# EAGLE schematic keyBoard_A (EAGLE 6.4)
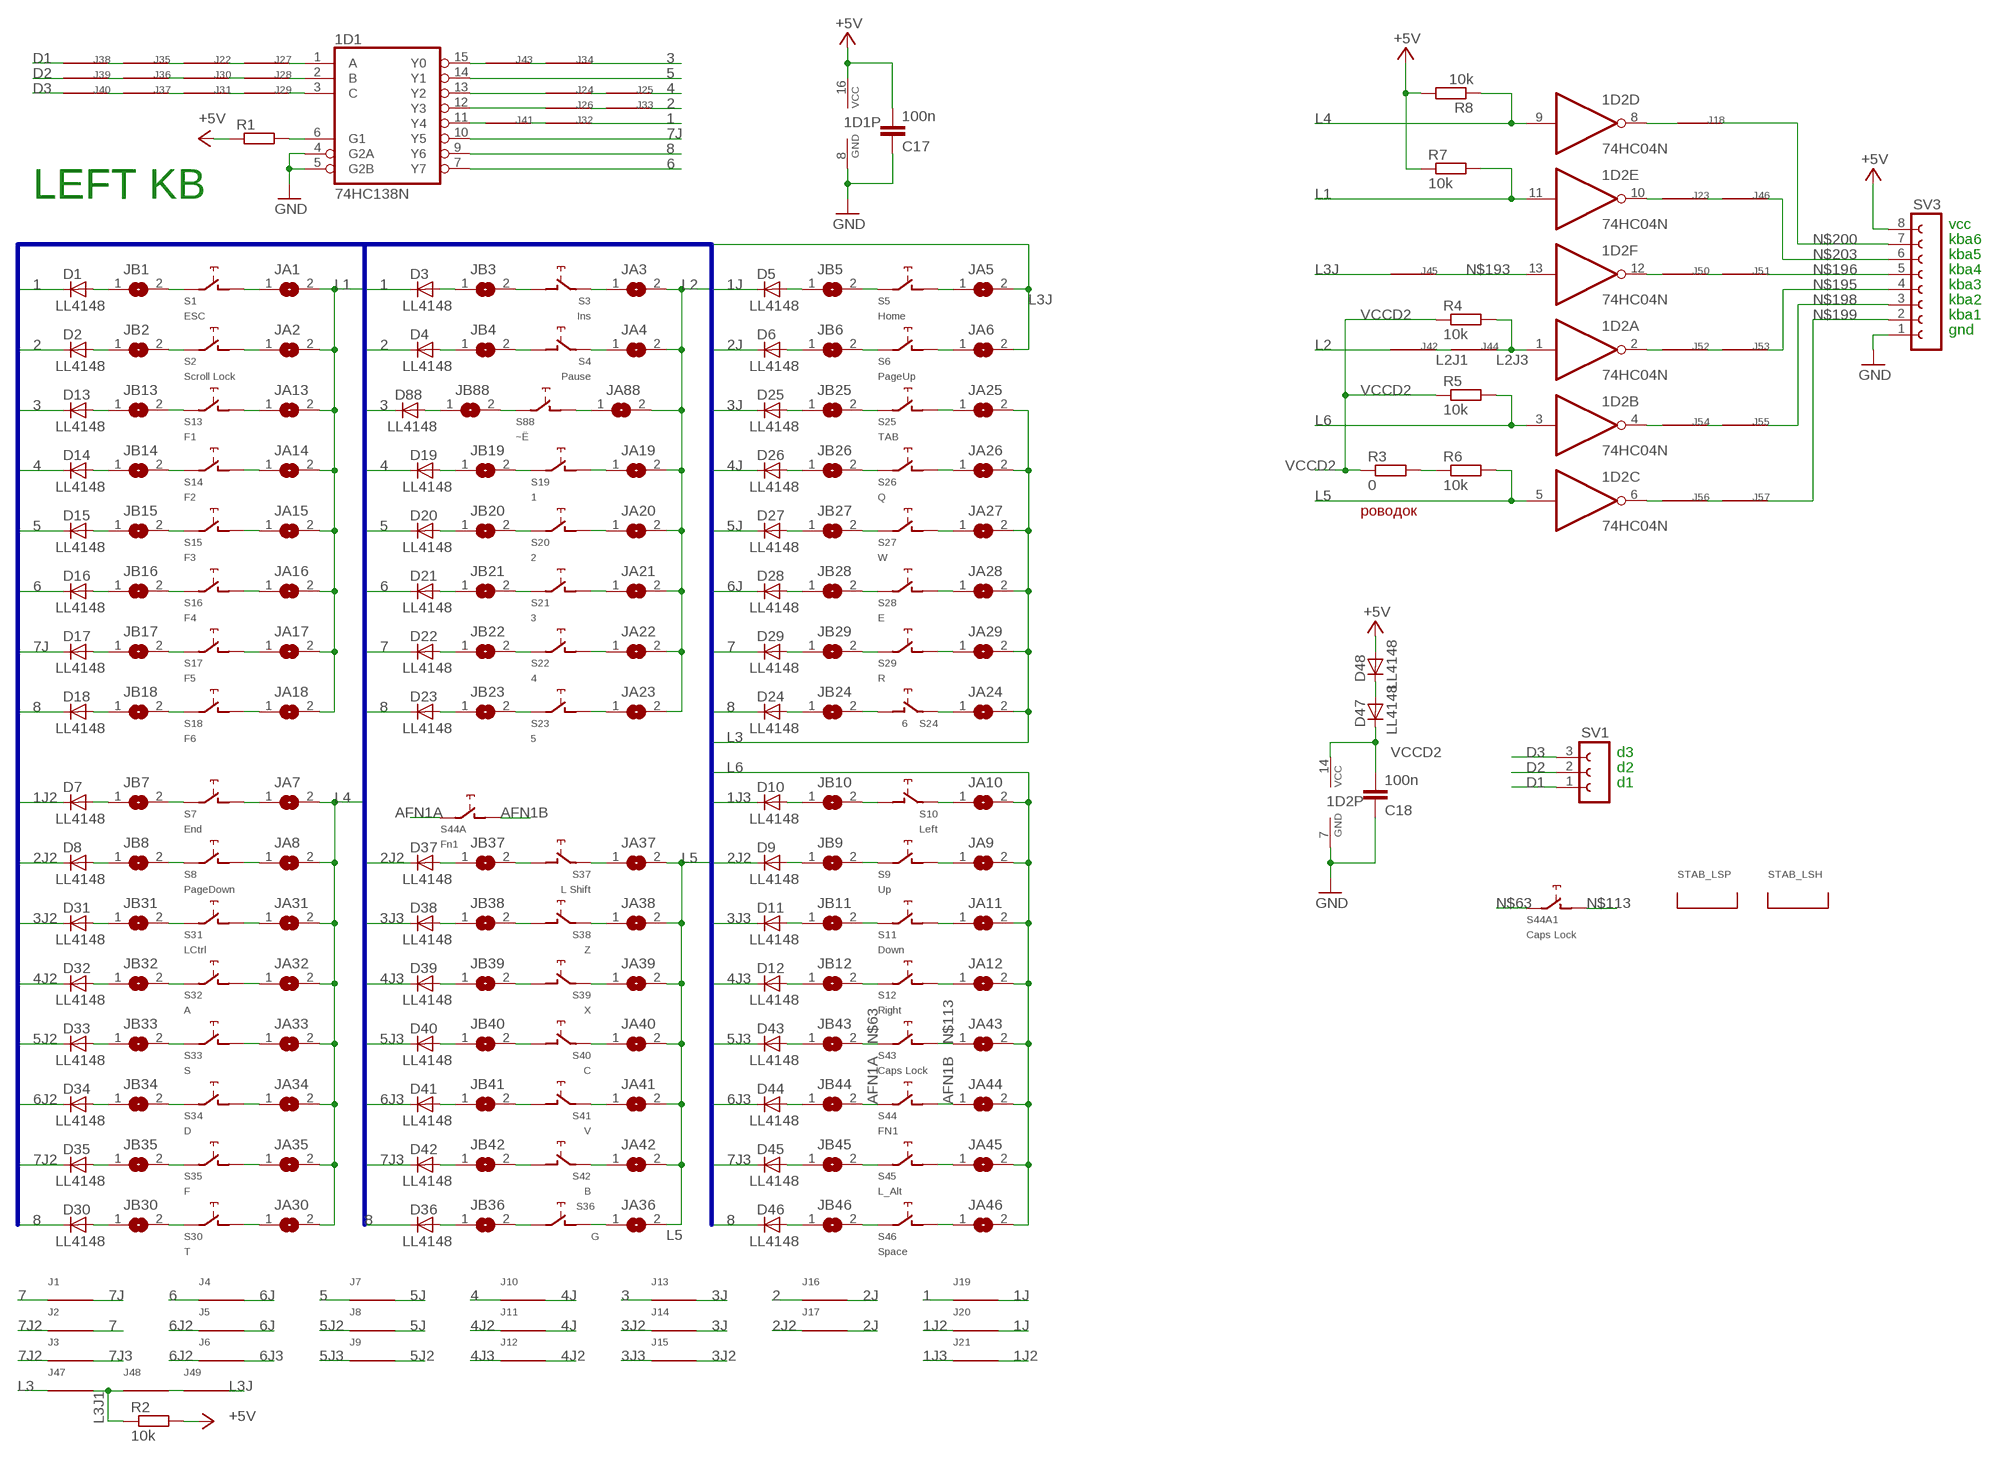
[diagram p0: schematic, sheet 1]

## Parts
1D1  74HC138N  [DIL16]
1D2  74HC04N  74ACT04N  [DIL14]
C17  100n  C-EUC0805  [C0805]
C18  100n  C-EUC0805  [C0805]
D1  LL4148  [SOD80C]
D2  LL4148  [SOD80C]
D3  LL4148  [SOD80C]
D4  LL4148  [SOD80C]
D5  LL4148  [SOD80C]
D6  LL4148  [SOD80C]
D7  LL4148  [SOD80C]
D8  LL4148  [SOD80C]
D9  LL4148  [SOD80C]
D10  LL4148  [SOD80C]
D11  LL4148  [SOD80C]
D12  LL4148  [SOD80C]
D13  LL4148  [SOD80C]
D14  LL4148  [SOD80C]
D15  LL4148  [SOD80C]
D16  LL4148  [SOD80C]
D17  LL4148  [SOD80C]
D18  LL4148  [SOD80C]
D19  LL4148  [SOD80C]
D20  LL4148  [SOD80C]
D21  LL4148  [SOD80C]
D22  LL4148  [SOD80C]
D23  LL4148  [SOD80C]
D24  LL4148  [SOD80C]
D25  LL4148  [SOD80C]
D26  LL4148  [SOD80C]
D27  LL4148  [SOD80C]
D28  LL4148  [SOD80C]
D29  LL4148  [SOD80C]
D30  LL4148  [SOD80C]
D31  LL4148  [SOD80C]
D32  LL4148  [SOD80C]
D33  LL4148  [SOD80C]
D34  LL4148  [SOD80C]
D35  LL4148  [SOD80C]
D36  LL4148  [SOD80C]
D37  LL4148  [SOD80C]
D38  LL4148  [SOD80C]
D39  LL4148  [SOD80C]
D40  LL4148  [SOD80C]
D41  LL4148  [SOD80C]
D42  LL4148  [SOD80C]
D43  LL4148  [SOD80C]
D44  LL4148  [SOD80C]
D45  LL4148  [SOD80C]
D46  LL4148  [SOD80C]
D47  LL4148  [SOD80C]
D48  LL4148  [SOD80C]
D88  LL4148  [SOD80C]
J1  J  [R1206W]
J2  J  [R1206W]
J3  J  [R1206W]
J4  J  [R1206W]
J5  J  [R1206W]
J6  J  [R1206W]
J7  J  [R1206W]
J8  J  [R1206W]
J9  J  [R1206W]
J10  J  [R1206W]
J11  J  [R1206W]
J12  J  [R1206W]
J13  J  [R1206W]
J14  J  [R1206W]
J15  J  [R1206W]
J16  J  [R1206W]
J17  J  [R1206W]
J18  J  [R1206W]
J19  J  [R1206W]
J20  J  [R1206W]
J21  J  [R1206W]
J22  J  [R1206W]
J23  J  [R1206W]
J24  J  [R1206W]
J25  J  [R1206W]
J26  J  [R1206W]
J27  J  [R1206W]
J28  J  [R1206W]
J29  J  [R1206W]
J30  J  [R1206W]
J31  J  [R1206W]
J32  J  [R1206W]
J33  J  [R1206W]
J34  J  [R1206W]
J35  J  [R1206W]
J36  J  [R1206W]
J37  J  [R1206W]
J38  J  [R1206W]
J39  J  [R1206W]
J40  J  [R1206W]
J41  J  [R1206W]
J42  J  [R1206W]
J43  J  [R1206W]
J44  J  [R1206W]
J45  J  [R1206W]
J46  J  [R1206W]
J47  J  [R1206W]
J48  J  [R1206W]
J49  J  [R1206W]
J50  J  [R1206W]
J51  J  [R1206W]
J52  J  [R1206W]
J53  J  [R1206W]
J54  J  [R1206W]
J55  J  [R1206W]
J56  J  [R1206W]
J57  J  [R1206W]
JA1  SJ  [SJ]
JA2  SJ  [SJ]
JA3  SJ  [SJ]
JA4  SJ  [SJ]
JA5  SJ  [SJ]
JA6  SJ  [SJ]
JA7  SJ  [SJ]
JA8  SJ  [SJ]
JA9  SJ  [SJ]
JA10  SJ  [SJ]
JA11  SJ  [SJ]
JA12  SJ  [SJ]
JA13  SJ  [SJ]
JA14  SJ  [SJ]
JA15  SJ  [SJ]
JA16  SJ  [SJ]
JA17  SJ  [SJ]
JA18  SJ  [SJ]
JA19  SJ  [SJ]
JA20  SJ  [SJ]
JA21  SJ  [SJ]
JA22  SJ  [SJ]
JA23  SJ  [SJ]
JA24  SJ  [SJ]
JA25  SJ  [SJ]
JA26  SJ  [SJ]
JA27  SJ  [SJ]
JA28  SJ  [SJ]
JA29  SJ  [SJ]
JA30  SJ  [SJ]
JA31  SJ  [SJ]
JA32  SJ  [SJ]
JA33  SJ  [SJ]
JA34  SJ  [SJ]
JA35  SJ  [SJ]
JA36  SJ  [SJ]
JA37  SJ  [SJ]
JA38  SJ  [SJ]
JA39  SJ  [SJ]
JA40  SJ  [SJ]
JA41  SJ  [SJ]
JA42  SJ  [SJ]
JA43  SJ  [SJ]
JA44  SJ  [SJ]
JA45  SJ  [SJ]
JA46  SJ  [SJ]
JA88  SJ  [SJ]
JB1  SJ  [SJ]
JB2  SJ  [SJ@1]
JB3  SJ  [SJ]
JB4  SJ  [SJ]
JB5  SJ  [SJ@1]
JB6  SJ  [SJ]
JB7  SJ  [SJ]
JB8  SJ  [SJ]
JB9  SJ  [SJ]
JB10  SJ  [SJ]
JB11  SJ  [SJ]
JB12  SJ  [SJ]
JB13  SJ  [SJ]
JB14  SJ  [SJ@1]
JB15  SJ  [SJ@1]
JB16  SJ  [SJ]
JB17  SJ  [SJ]
JB18  SJ  [SJ]
JB19  SJ  [SJ]
JB20  SJ  [SJ]
JB21  SJ  [SJ]
JB22  SJ  [SJ]
JB23  SJ  [SJ]
JB24  SJ  [SJ]
JB25  SJ  [SJ]
JB26  SJ  [SJ]
JB27  SJ  [SJ]
JB28  SJ  [SJ]
JB29  SJ  [SJ]
JB30  SJ  [SJ]
JB31  SJ  [SJ]
JB32  SJ  [SJ]
JB33  SJ  [SJ]
JB34  SJ  [SJ]
JB35  SJ  [SJ]
JB36  SJ  [SJ]
JB37  SJ  [SJ]
JB38  SJ  [SJ]
JB39  SJ  [SJ]
JB40  SJ  [SJ]
JB41  SJ  [SJ]
JB42  SJ  [SJ]
JB43  SJ  [SJ]
JB44  SJ  [SJ]
JB45  SJ  [SJ]
JB46  SJ  [SJ]
JB88  SJ  [SJ]
R1  R-EU_R1206W  [R1206W]
R2  10k  R-EU_R1206W  [R1206W]
R3  0  R-EU_R1206W  [R1206W]
R4  10k  R-EU_R0805  [R0805]
R5  10k  R-EU_R1206W  [R1206W]
R6  10k  R-EU_R1206W  [R1206W]
R7  10k  R-EU_R1206W  [R1206W]
R8  10k  R-EU_R0805  [R0805]
S1  ESC  CHERRY-MX-4P  [CHERRY-MX-4P]
S2  Scroll Lock  CHERRY-MX-4P  [CHERRY-MX-4P]
S3  Ins  CHERRY-MX-4P  [CHERRY-MX-4P]
S4  Pause  CHERRY-MX-4P  [CHERRY-MX-4P]
S5  Home  CHERRY-MX-4P  [CHERRY-MX-4P]
S6  PageUp  CHERRY-MX-4P  [CHERRY-MX-4P]
S7  End  CHERRY-MX-4P  [CHERRY-MX-4P]
S8  PageDown  CHERRY-MX-4P  [CHERRY-MX-4P]
S9  Up  CHERRY-MX-4P  [CHERRY-MX-4P]
S10  Left  CHERRY-MX-4P  [CHERRY-MX-4P]
S11  Down  CHERRY-MX-4P  [CHERRY-MX-4P]
S12  Right  CHERRY-MX-4P  [CHERRY-MX-4P]
S13  F1  CHERRY-MX-4P  [CHERRY-MX-4P]
S14  F2  CHERRY-MX-4P  [CHERRY-MX-4P]
S15  F3  CHERRY-MX-4P  [CHERRY-MX-4P]
S16  F4  CHERRY-MX-4P  [CHERRY-MX-4P]
S17  F5  CHERRY-MX-4P  [CHERRY-MX-4P]
S18  F6  CHERRY-MX-4P  [CHERRY-MX-4P]
S19  1  CHERRY-MX-4P  [CHERRY-MX-4P]
S20  2  CHERRY-MX-4P  [CHERRY-MX-4P]
S21  3  CHERRY-MX-4P  [CHERRY-MX-4P]
S22  4  CHERRY-MX-4P  [CHERRY-MX-4P]
S23  5  CHERRY-MX-4P  [CHERRY-MX-4P]
S24  6  CHERRY-MX-4P  [CHERRY-MX-4P]
S25  TAB  CHERRY-MX-4P  [CHERRY-MX-4P]
S26  Q  CHERRY-MX-4P  [CHERRY-MX-4P]
S27  W  CHERRY-MX-4P  [CHERRY-MX-4P]
S28  E  CHERRY-MX-4P  [CHERRY-MX-4P]
S29  R  CHERRY-MX-4P  [CHERRY-MX-4P]
S30  T  CHERRY-MX-4P  [CHERRY-MX-4P]
S31  LCtrl  CHERRY-MX-4P  [CHERRY-MX-4P]
S32  A  CHERRY-MX-4P  [CHERRY-MX-4P]
S33  S  CHERRY-MX-4P  [CHERRY-MX-4P]
S34  D  CHERRY-MX-4P  [CHERRY-MX-4P]
S35  F  CHERRY-MX-4P  [CHERRY-MX-4P]
S36  G  CHERRY-MX-4P  [CHERRY-MX-4P]
S37  L Shift  CHERRY-MX-4P  [CHERRY-MX-4P]
S38  Z  CHERRY-MX-4P  [CHERRY-MX-4P]
S39  X  CHERRY-MX-4P  [CHERRY-MX-4P]
S40  C  CHERRY-MX-4P  [CHERRY-MX-4P]
S41  V  CHERRY-MX-4P  [CHERRY-MX-4P]
S42  B  CHERRY-MX-4P  [CHERRY-MX-4P]
S43  Caps Lock  CHERRY-MX-4P  [CHERRY-MX-4P]
S44  FN1  CHERRY-MX-4P  [CHERRY-MX-4P]
S44A  Fn1  CHERRY-MX  [CHERRY-MX]
S44A1  Caps Lock  CHERRY-MX  [CHERRY-MX]
S45  L_Alt  CHERRY-MX-4P  [CHERRY-MX-4P]
S46  Space  CHERRY-MX-4P  [CHERRY-MX-4P]
S88  ~Ё  CHERRY-MX-4P  [CHERRY-MX-4P]
STAB_LSH  STAB  [ZEALIOS-PCB_2U]
STAB_LSP  STAB  [ZEALIOS-PCB_2U]
SV1  FE03-1  [FE03-1]
SV3  FE08-1  [FE08]

## Nets
1: D1.C D3.C J19.2 J32.1
1J: D5.C J19.1 J20.1
1J2: D7.C J20.2 J21.1
1J3: D10.C J21.2
2: D2.C D4.C J16.2 J33.1
2J: D6.C J16.1 J17.1
2J2: D8.C D9.C D37.C J17.2
3: D13.C D88.C J13.2 J34.1
3J: D25.C J13.1 J14.1
3J2: D31.C J14.2 J15.1
3J3: D11.C D38.C J15.2
4: D14.C D19.C J10.2 J25.1
4J: D26.C J10.1 J11.1
4J2: D32.C J11.2 J12.1
4J3: D12.C D39.C J12.2
5: 1D1.14(Y1) D15.C D20.C J7.2
5J: D27.C J7.1 J8.1
5J2: D33.C J8.2 J9.1
5J3: D40.C D43.C J9.2
6: 1D1.7(Y7) D16.C D21.C J4.2
6J: D28.C J4.1 J5.1
6J2: D34.C J5.2 J6.2
6J3: D41.C D44.C J6.1
7: D22.C D29.C J1.2 J2.1
7J: 1D1.10(Y5) D17.C J1.1
7J2: D35.C J2.2 J3.2
7J3: D42.C D45.C J3.1
8: 1D1.9(Y6) D18.C D23.C D24.C D30.C D36.C D46.C
+5V: 1D1.16(VCC) C17.2 D48.A R1.1 R2.2 R7.1 R8.2 SV3.8
AFN1A: JB44.2 S44.SW1(PIN-1) S44A.SW1(PIN-1)
AFN1B: JA44.1 S44.SW2(PIN-2) S44A.SW2(PIN-2)
D1: J38.2 SV1.1
D2: J39.2 SV1.2
D3: J40.2 SV1.3
GND: 1D1.4(G2A) 1D1.5(G2B) 1D1.8(GND) 1D2.7(P:GND) C17.1 C18.1 SV3.1
L1: 1D2.11(E:I) JA1.2 JA2.2 JA13.2 JA14.2 JA15.2 JA16.2 JA17.2 JA18.2 R7.2
L2: J42.2 JA3.2 JA4.2 JA19.2 JA20.2 JA21.2 JA22.2 JA23.2 JA88.2
L2J1: J42.1 J44.2
L2J3: 1D2.1(A:I) J44.1 R4.2
L3: J47.2 JA24.2 JA25.2 JA26.2 JA27.2 JA28.2 JA29.2
L3J: J45.2 J49.1 JA5.2 JA6.2
L3J1: J47.1 J48.2 R2.1
L4: 1D2.9(D:I) JA7.2 JA8.2 JA30.2 JA31.2 JA32.2 JA33.2 JA34.2 JA35.2 R8.1
L5: 1D2.5(C:I) JA36.2 JA37.2 JA38.2 JA39.2 JA40.2 JA41.2 JA42.2 R6.2
L5O: 1D2.6(C:O) J56.2
L6: 1D2.3(B:I) JA9.2 JA10.2 JA11.2 JA12.2 JA43.2 JA44.2 JA45.2 JA46.2 R5.2
N$1: D15.A JB15.1
N$2: JB4.2 S4.SW2(PIN-2)
N$3: D1.A JB1.1
N$4: JA4.1 S4.SW1(PIN-1)
N$5: JB14.2 S14.SW1(PIN-1)
N$6: JB20.2 S20.SW1(PIN-1)
N$7: JB32.2 S32.SW1(PIN-1)
N$8: JB38.2 S38.SW2(PIN-2)
N$9: JB6.2 S6.SW1(PIN-1)
N$10: JA6.1 S6.SW2(PIN-2)
N$11: JA8.1 S8.SW2(PIN-2)
N$12: JB8.2 S8.SW1(PIN-1)
N$13: JB10.2 S10.SW2(PIN-2)
N$14: JB1.2 S1.SW1(PIN-1)
N$15: D2.A JB2.1
N$16: JB2.2 S2.SW1(PIN-1)
N$17: JA2.1 S2.SW2(PIN-2)
N$18: D16.A JB16.1
N$19: JB3.2 S3.SW2(PIN-2)
N$20: JB5.2 S5.SW1(PIN-1)
N$21: JB7.2 S7.SW1(PIN-1)
N$22: JB9.2 S9.SW1(PIN-1)
N$23: JB11.2 S11.SW1(PIN-1)
N$24: D3.A JB3.1
N$25: JB12.2 S12.SW1(PIN-1)
N$26: D5.A JB5.1
N$27: D7.A JB7.1
N$28: JA10.1 S10.SW1(PIN-1)
N$29: JA1.1 S1.SW2(PIN-2)
N$30: D9.A JB9.1
N$31: D11.A JB11.1
N$32: JA3.1 S3.SW1(PIN-1)
N$33: JA5.1 S5.SW2(PIN-2)
N$34: JA7.1 S7.SW2(PIN-2)
N$35: JA9.1 S9.SW2(PIN-2)
N$36: JA11.1 S11.SW2(PIN-2)
N$37: JA12.1 S12.SW2(PIN-2)
N$38: JA14.1 S14.SW2(PIN-2)
N$39: JB13.2 S13.SW1(PIN-1)
N$40: JA13.1 S13.SW2(PIN-2)
N$41: D14.A JB14.1
N$42: JB42.2 S42.SW2(PIN-2)
N$43: JA42.1 S42.SW1(PIN-1)
N$44: JB27.2 S27.SW1(PIN-1)
N$45: JA27.1 S27.SW2(PIN-2)
N$46: JB17.2 S17.SW1(PIN-1)
N$47: JA17.1 S17.SW2(PIN-2)
N$48: D24.A JB24.1
N$49: JB24.2 S24.SW2(PIN-2)
N$50: JA24.1 S24.SW1(PIN-1)
N$51: J22.1 J27.2
N$52: D4.A JB4.1
N$53: D6.A JB6.1
N$54: D8.A JB8.1
N$55: D10.A JB10.1
N$56: D12.A JB12.1
N$57: D13.A JB13.1
N$58: JB19.2 S19.SW1(PIN-1)
N$59: JB25.2 S25.SW1(PIN-1)
N$60: 1D2.8(D:O) J18.2
N$61: JB31.2 S31.SW1(PIN-1)
N$62: JB37.2 S37.SW2(PIN-2)
N$63: JB43.2 S43.SW1(PIN-1) S44A1.SW1(PIN-1)
N$64: JB26.2 S26.SW1(PIN-1)
N$65: JB41.2 S41.SW2(PIN-2)
N$66: JB18.2 S18.SW1(PIN-1)
N$67: 1D1.13(Y2) J24.2
N$68: JB30.2 S30.SW1(PIN-1)
N$69: JB36.2 S36.SW1(PIN-1)
N$70: J24.1 J25.2
N$72: JB23.2 S23.SW1(PIN-1)
N$73: JB29.2 S29.SW1(PIN-1)
N$74: JB35.2 S35.SW1(PIN-1)
N$75: JA41.1 S41.SW1(PIN-1)
N$76: JB16.2 S16.SW1(PIN-1)
N$77: JB22.2 S22.SW1(PIN-1)
N$78: JB28.2 S28.SW1(PIN-1)
N$79: JB34.2 S34.SW1(PIN-1)
N$80: JB40.2 S40.SW2(PIN-2)
N$81: JB46.2 S46.SW1(PIN-1)
N$82: JB15.2 S15.SW1(PIN-1)
N$83: JB21.2 S21.SW1(PIN-1)
N$85: JB33.2 S33.SW1(PIN-1)
N$86: JB39.2 S39.SW2(PIN-2)
N$87: JB45.2 S45.SW1(PIN-1)
N$88: JA15.1 S15.SW2(PIN-2)
N$90: JA18.1 S18.SW2(PIN-2)
N$91: JA20.1 S20.SW2(PIN-2)
N$92: JA22.1 S22.SW2(PIN-2)
N$93: JA23.1 S23.SW2(PIN-2)
N$95: JA25.1 S25.SW2(PIN-2)
N$96: JA26.1 S26.SW2(PIN-2)
N$98: JA28.1 S28.SW2(PIN-2)
N$99: JA29.1 S29.SW2(PIN-2)
N$100: JA30.1 S30.SW2(PIN-2)
N$101: JA31.1 S31.SW2(PIN-2)
N$102: JA32.1 S32.SW2(PIN-2)
N$103: JA33.1 S33.SW2(PIN-2)
N$104: JA34.1 S34.SW2(PIN-2)
N$105: JA35.1 S35.SW2(PIN-2)
N$106: JA36.1 S36.SW2(PIN-2)
N$108: JA38.1 S38.SW1(PIN-1)
N$109: JA39.1 S39.SW1(PIN-1)
N$110: JA40.1 S40.SW1(PIN-1)
N$111: JB88.2 S88.SW1(PIN-1)
N$113: JA43.1 S43.SW2(PIN-2) S44A1.SW2(PIN-2)
N$114: JA45.1 S45.SW2(PIN-2)
N$115: JA46.1 S46.SW2(PIN-2)
N$116: JA19.1 S19.SW2(PIN-2)
N$117: JA88.1 S88.SW2(PIN-2)
N$118: JA21.1 S21.SW2(PIN-2)
N$119: JA16.1 S16.SW2(PIN-2)
N$120: D17.A JB17.1
N$121: D18.A JB18.1
N$122: D19.A JB19.1
N$123: D20.A JB20.1
N$124: D21.A JB21.1
N$125: D22.A JB22.1
N$126: D23.A JB23.1
N$128: D25.A JB25.1
N$129: D26.A JB26.1
N$130: D27.A JB27.1
N$131: D28.A JB28.1
N$132: D29.A JB29.1
N$133: D30.A JB30.1
N$134: D31.A JB31.1
N$135: D32.A JB32.1
N$136: D33.A JB33.1
N$137: D34.A JB34.1
N$138: D35.A JB35.1
N$139: D36.A JB36.1
N$140: D37.A JB37.1
N$141: D38.A JB38.1
N$142: D39.A JB39.1
N$143: D40.A JB40.1
N$144: D41.A JB41.1
N$145: D42.A JB42.1
N$146: D43.A JB43.1
N$147: D44.A JB44.1
N$148: D45.A JB45.1
N$149: D46.A JB46.1
N$151: D88.A JB88.1
N$158: 1D1.15(Y0) J43.2
N$163: 1D1.1(A) J27.1
N$165: 1D1.2(B) J28.1
N$172: 1D1.3(C) J29.1
N$175: J28.2 J30.1
N$176: J29.2 J31.1
N$178: J26.1 J33.2
N$182: J35.2 J38.1
N$183: J36.2 J39.1
N$184: J37.2 J40.1
N$185: J31.2 J37.1
N$186: J30.2 J36.1
N$187: J22.2 J35.1
N$188: J32.2 J41.1
N$189: 1D1.11(Y4) J41.2
N$190: 1D1.12(Y3) J26.2
N$191: J34.2 J43.1
N$192: D47.A D48.C
N$193: 1D2.13(F:I) J45.1
N$195: J53.1 SV3.4
N$196: J51.1 SV3.5
N$197: 1D2.10(E:O) J23.2
N$198: J55.1 SV3.3
N$199: J57.1 SV3.2
N$200: J18.1 SV3.7
N$203: J46.1 SV3.6
N$224: J48.1 J49.2
N$225: J23.1 J46.2
N$229: 1D2.12(F:O) J50.2
N$230: J50.1 J51.2
N$231: 1D2.2(A:O) J52.2
N$232: J52.1 J53.2
N$233: 1D2.4(B:O) J54.2
N$234: JA37.1 S37.SW1(PIN-1)
N$235: J54.1 J55.2
N$237: J56.1 J57.2
N$238: R3.2 R6.1
N$390: 1D1.6(G1) R1.2
VCCD2: 1D2.14(P:VCC) C18.2 D47.C R3.1 R4.1 R5.1
Unconnected: S1.D1(_D:D1) S1.D2(_D:D2) S1.LED1(_L:LED1) S1.LED2(_L:LED2) S2.D1(_D:D1) S2.D2(_D:D2) S2.LED1(_L:LED1) S2.LED2(_L:LED2) S3.D1(_D:D1) S3.D2(_D:D2) S3.LED1(_L:LED1) S3.LED2(_L:LED2) S4.D1(_D:D1) S4.D2(_D:D2) S4.LED1(_L:LED1) S4.LED2(_L:LED2) S5.D1(_D:D1) S5.D2(_D:D2) S5.LED1(_L:LED1) S5.LED2(_L:LED2) S6.D1(_D:D1) S6.D2(_D:D2) S6.LED1(_L:LED1) S6.LED2(_L:LED2) S7.D1(_D:D1) S7.D2(_D:D2) S7.LED1(_L:LED1) S7.LED2(_L:LED2) S8.D1(_D:D1) S8.D2(_D:D2) S8.LED1(_L:LED1) S8.LED2(_L:LED2) S9.D1(_D:D1) S9.D2(_D:D2) S9.LED1(_L:LED1) S9.LED2(_L:LED2) S10.D1(_D:D1) S10.D2(_D:D2) S10.LED1(_L:LED1) S10.LED2(_L:LED2) S11.D1(_D:D1) S11.D2(_D:D2) S11.LED1(_L:LED1) S11.LED2(_L:LED2) S12.D1(_D:D1) S12.D2(_D:D2) S12.LED1(_L:LED1) S12.LED2(_L:LED2) S13.D1(_D:D1) S13.D2(_D:D2) S13.LED1(_L:LED1) S13.LED2(_L:LED2) S14.D1(_D:D1) S14.D2(_D:D2) S14.LED1(_L:LED1) S14.LED2(_L:LED2) S15.D1(_D:D1) S15.D2(_D:D2) S15.LED1(_L:LED1) S15.LED2(_L:LED2) S16.D1(_D:D1) S16.D2(_D:D2) S16.LED1(_L:LED1) S16.LED2(_L:LED2) S17.D1(_D:D1) S17.D2(_D:D2) S17.LED1(_L:LED1) S17.LED2(_L:LED2) S18.D1(_D:D1) S18.D2(_D:D2) S18.LED1(_L:LED1) S18.LED2(_L:LED2) S19.D1(_D:D1) S19.D2(_D:D2) S19.LED1(_L:LED1) S19.LED2(_L:LED2) S20.D1(_D:D1) S20.D2(_D:D2) S20.LED1(_L:LED1) S20.LED2(_L:LED2) S21.D1(_D:D1) S21.D2(_D:D2) S21.LED1(_L:LED1) S21.LED2(_L:LED2) S22.D1(_D:D1) S22.D2(_D:D2) S22.LED1(_L:LED1) S22.LED2(_L:LED2) S23.D1(_D:D1) S23.D2(_D:D2) S23.LED1(_L:LED1) S23.LED2(_L:LED2) S24.D1(_D:D1) S24.D2(_D:D2) S24.LED1(_L:LED1) S24.LED2(_L:LED2) S25.D1(_D:D1) S25.D2(_D:D2) S25.LED1(_L:LED1) S25.LED2(_L:LED2) S26.D1(_D:D1) S26.D2(_D:D2) S26.LED1(_L:LED1) S26.LED2(_L:LED2) S27.D1(_D:D1) S27.D2(_D:D2) S27.LED1(_L:LED1) S27.LED2(_L:LED2) S28.D1(_D:D1) S28.D2(_D:D2) S28.LED1(_L:LED1) S28.LED2(_L:LED2) S29.D1(_D:D1) S29.D2(_D:D2) S29.LED1(_L:LED1) S29.LED2(_L:LED2) S30.D1(_D:D1) S30.D2(_D:D2) S30.LED1(_L:LED1) S30.LED2(_L:LED2) S31.D1(_D:D1) S31.D2(_D:D2) S31.LED1(_L:LED1) S31.LED2(_L:LED2) S32.D1(_D:D1) S32.D2(_D:D2) S32.LED1(_L:LED1) S32.LED2(_L:LED2) S33.D1(_D:D1) S33.D2(_D:D2) S33.LED1(_L:LED1) S33.LED2(_L:LED2) S34.D1(_D:D1) S34.D2(_D:D2) S34.LED1(_L:LED1) S34.LED2(_L:LED2) S35.D1(_D:D1) S35.D2(_D:D2) S35.LED1(_L:LED1) S35.LED2(_L:LED2) S36.D1(_D:D1) S36.D2(_D:D2) S36.LED1(_L:LED1) S36.LED2(_L:LED2) S37.D1(_D:D1) S37.D2(_D:D2) S37.LED1(_L:LED1) S37.LED2(_L:LED2) S38.D1(_D:D1) S38.D2(_D:D2) S38.LED1(_L:LED1) S38.LED2(_L:LED2) S39.D1(_D:D1) S39.D2(_D:D2) S39.LED1(_L:LED1) S39.LED2(_L:LED2) S40.D1(_D:D1) S40.D2(_D:D2) S40.LED1(_L:LED1) S40.LED2(_L:LED2) S41.D1(_D:D1) S41.D2(_D:D2) S41.LED1(_L:LED1) S41.LED2(_L:LED2) S42.D1(_D:D1) S42.D2(_D:D2) S42.LED1(_L:LED1) S42.LED2(_L:LED2) S43.D1(_D:D1) S43.D2(_D:D2) S43.LED1(_L:LED1) S43.LED2(_L:LED2) S44.D1(_D:D1) S44.D2(_D:D2) S44.LED1(_L:LED1) S44.LED2(_L:LED2) S45.D1(_D:D1) S45.D2(_D:D2) S45.LED1(_L:LED1) S45.LED2(_L:LED2) S46.D1(_D:D1) S46.D2(_D:D2) S46.LED1(_L:LED1) S46.LED2(_L:LED2) S88.D1(_D:D1) S88.D2(_D:D2) S88.LED1(_L:LED1) S88.LED2(_L:LED2)

## Buses
L[1..6],L3J,1,2,3,4,5,6,7,8,1J,2J,3J,4J,5J,6J,7J,1J2,1J3,2J2,2J3,3J2,3J3,4J2,4J3,5J2,5J3,6J2,6J3,7J2,7J3,7J4

## Notes on the sheet
- LEFT KB
- vcc
- kba6
- kba5
- kba4
- kba3
- kba2
- kba1
- gnd
- роводок
- d3
- d2
- d1

## Library data of the parts
1D1 = detali_main:74*138: 3-line to 8-line DECODER/DEMULTIPLEXER
1D2 = detali_main:74*04: Hex INVERTER
C17 C18 = rcl:C-EU: CAPACITOR, European symbol
D1-D48 D88 = detali:LL4148: DIODE high speed
J1-J57 = detali_main:J
JA1-JA12 JA43 JB4 JB6-JB13 JB16 JB17 = detali_main:SJ: SMD solder JUMPER
JA13-JA42 JA44-JA46 JA88 JB1 JB3 JB18-JB46 JB88 = detali:SJ: SMD solder JUMPER
JB2 JB5 JB14 JB15 = jumper:SJ: SMD solder JUMPER
R1-R8 = rcl:R-EU_: RESISTOR, European symbol
S1-S46 S88 = cherrymx:CHERRY-MX-4P
S44A S44A1 = cherrymx:CHERRY-MX: Cherry MX series keyswitch
STAB_LSH STAB_LSP = kbmxco:STAB
SV1 = detali_main:FE03-1: FEMALE HEADER; OC_FARNELL: unknown; OC_NEWARK: unknown
SV3 = detali_main:FE08-1: FEMALE HEADER; OC_FARNELL: unknown; OC_NEWARK: unknown

## Net classes
1 power: width 0.254 mm, drill 0.61 mm, clearance 0.254 mm
2 gnd: width 0.305 mm, drill 0.559 mm, clearance 0.254 mm
3 usbvcc: width 0.254 mm, drill 0.61 mm, clearance 0.254 mm
4 aref: width 0.254 mm, drill 0.61 mm, clearance 0.254 mm